# Altium schematic sheet Power.SchDoc
size A3; SheetNumber: 2; SheetTotal: 5
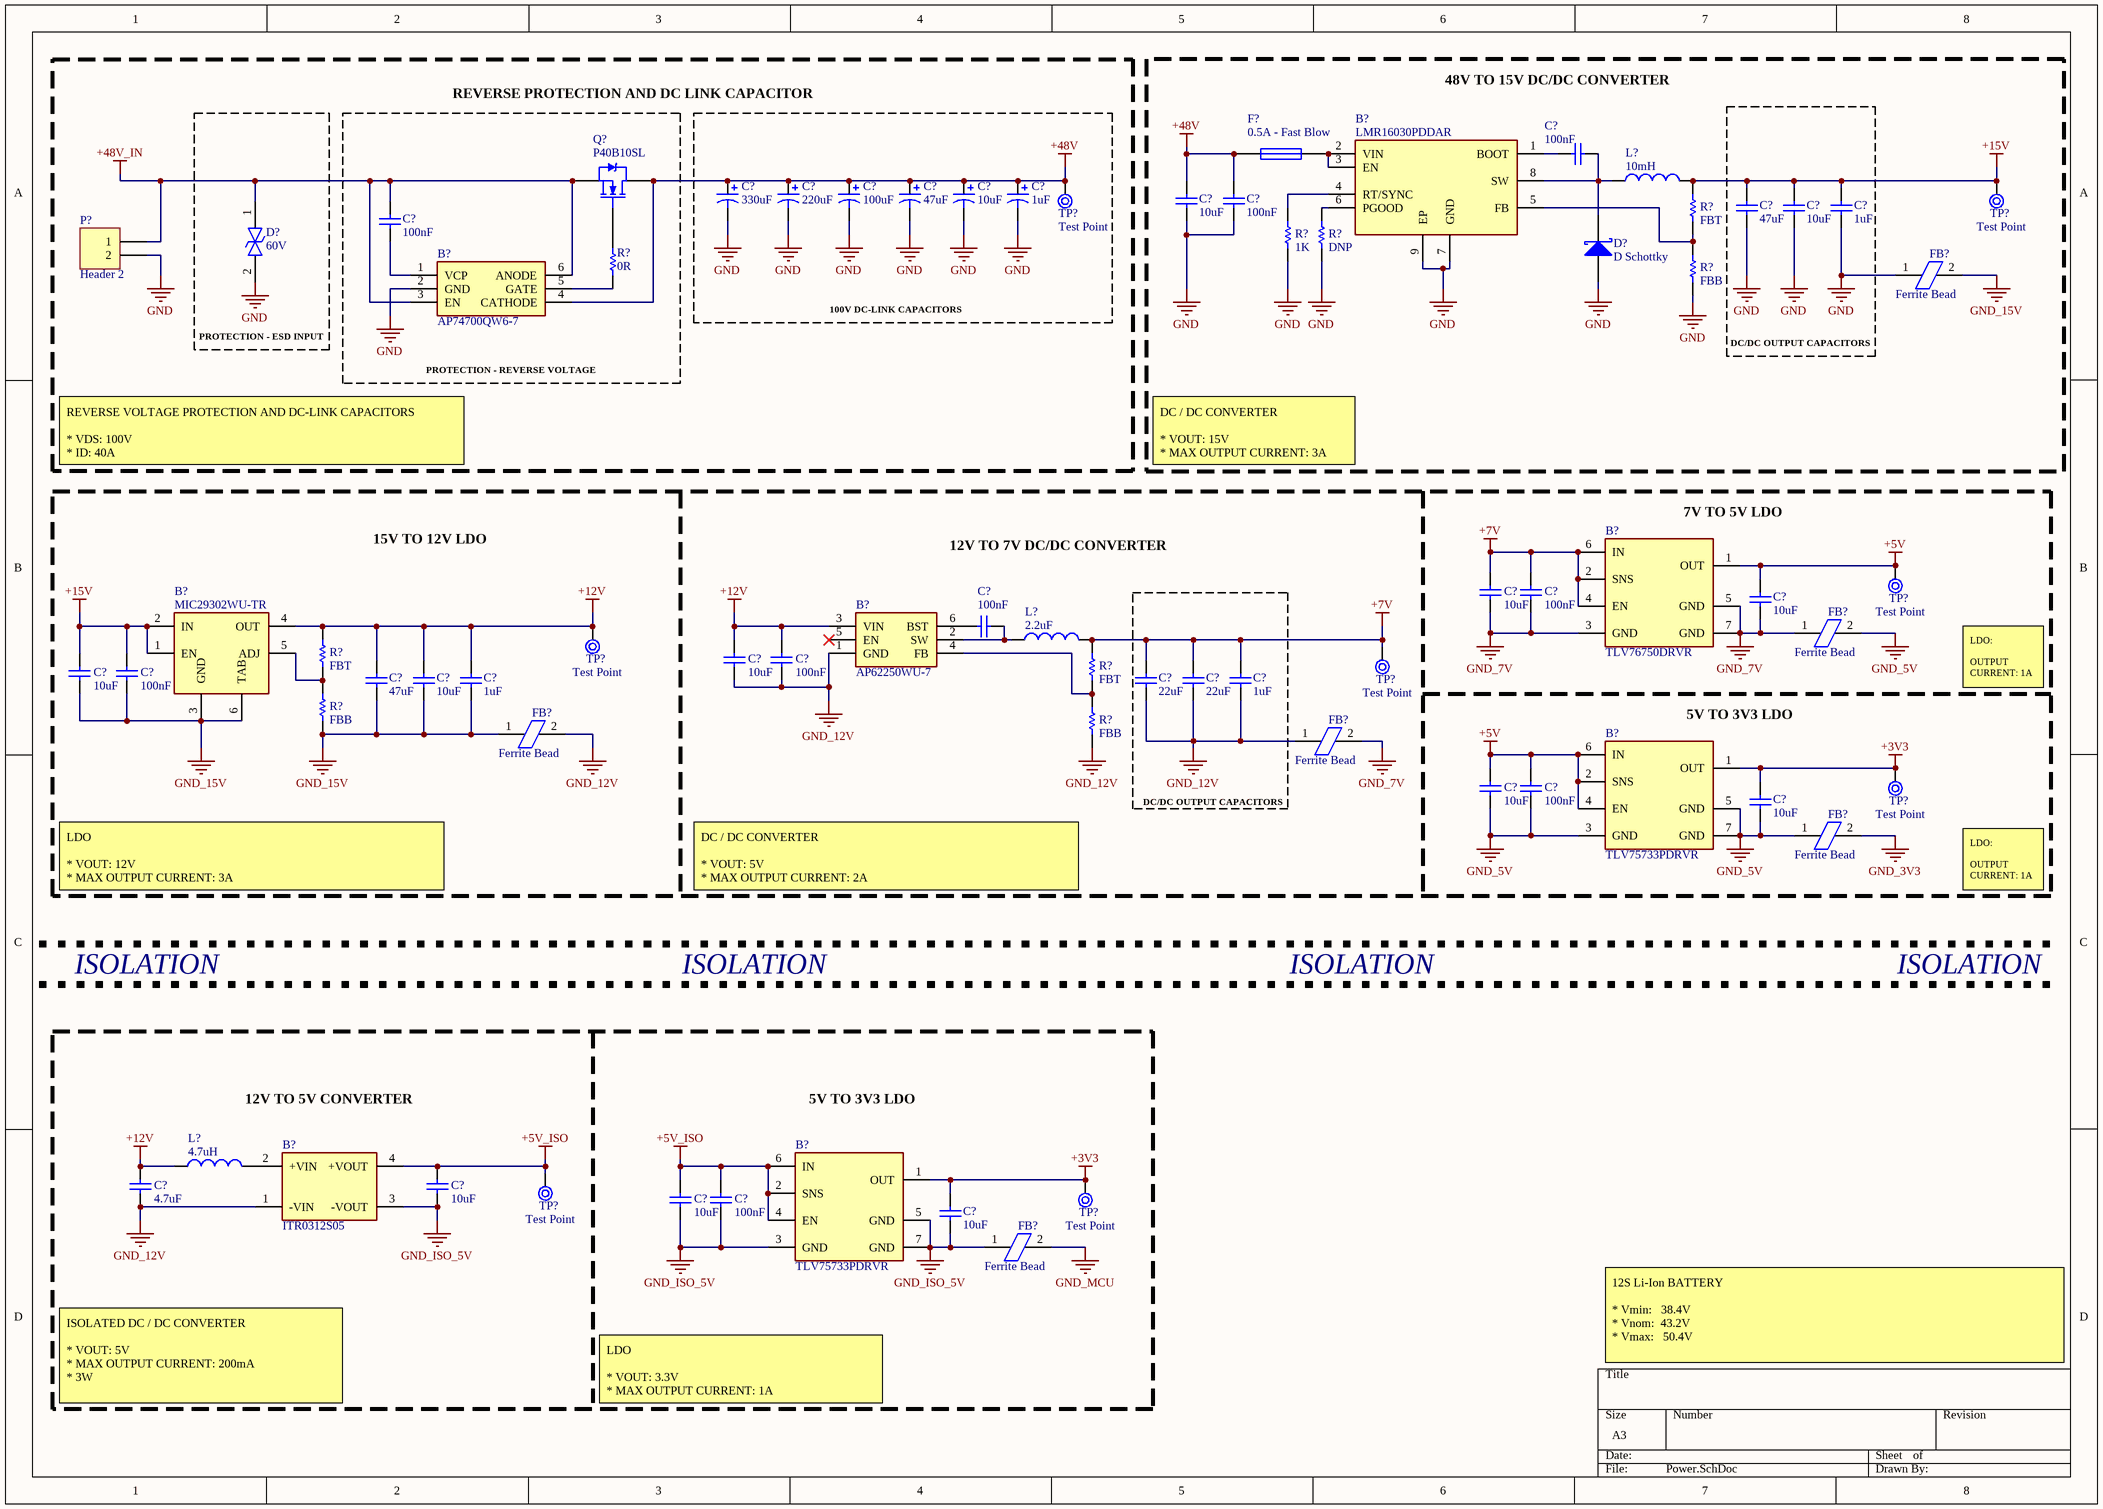
[diagram p0: Power.SchDoc]

## Parts
(Parts that share a designator on the sheet are numbered #1, #2 ... from top to bottom, then left to right.)
B?#1  LMR16030PDDAR
B?#2  AP74700QW6-7
B?#3  TLV76750DRVR  [WSON-6]
B?#4  AP62250WU-7  [TSOT-26-6]
B?#5  MIC29302WU-TR  [TO263-5]
B?#6  TLV75733PDRVR  [WSON-6]
B?#7  TLV75733PDRVR  [WSON-6]
B?#8  ITR0312S05  [SIP-4]
C?#1  value 100nF  (hidden comment: Cap)
C?#2  value 330uF  (hidden comment: Cap Pol2)
C?#3  value 220uF  (hidden comment: Cap Pol2)
C?#4  value 100uF  (hidden comment: Cap Pol2)
C?#5  value 47uF  (hidden comment: Cap Pol2)
C?#6  value 10uF  (hidden comment: Cap Pol2)
C?#7  value 1uF  (hidden comment: Cap Pol2)
C?#8  value 10uF  (hidden comment: Cap)
C?#9  value 100nF  (hidden comment: Cap)
C?#10  value 47uF  (hidden comment: Cap)
C?#11  value 10uF  (hidden comment: Cap)
C?#12  value 1uF  (hidden comment: Cap)
C?#13  value 100nF  (hidden comment: Cap)
C?#14  value 10uF  (hidden comment: Cap)
C?#15  value 100nF  (hidden comment: Cap)
C?#16  value 10uF  (hidden comment: Cap)
C?#17  value 100nF  (hidden comment: Cap)
C?#18  value 10uF  (hidden comment: Cap)
C?#19  value 100nF  (hidden comment: Cap)
C?#20  value 10uF  (hidden comment: Cap)
C?#21  value 100nF  (hidden comment: Cap)
C?#22  value 47uF  (hidden comment: Cap)
C?#23  value 10uF  (hidden comment: Cap)
C?#24  value 1uF  (hidden comment: Cap)
C?#25  value 22uF  (hidden comment: Cap)
C?#26  value 22uF  (hidden comment: Cap)
C?#27  value 1uF  (hidden comment: Cap)
C?#28  value 10uF  (hidden comment: Cap)
C?#29  value 100nF  (hidden comment: Cap)
C?#30  value 10uF  (hidden comment: Cap)
C?#31  value 4.7uF  (hidden comment: Cap)
C?#32  value 10uF  (hidden comment: Cap)
C?#33  value 10uF  (hidden comment: Cap)
C?#34  value 100nF  (hidden comment: Cap)
C?#35  value 10uF  (hidden comment: Cap)
D?#1  60V
D?#2  D Schottky
F?  0.5A - Fast Blow
FB?#1  Ferrite Bead
FB?#2  Ferrite Bead
FB?#3  Ferrite Bead
FB?#4  Ferrite Bead
FB?#5  Ferrite Bead
FB?#6  Ferrite Bead
L?#1  value 10mH  (hidden comment: Inductor)
L?#2  value 2.2uF  (hidden comment: Inductor)
L?#3  value 4.7uH  (hidden comment: Inductor)
P?  Header 2  [HDR1X2]
Q?  P40B10SL
R?#1  value FBT  (hidden comment: Res Small)
R?#2  value 0R  (hidden comment: Res Small)
R?#3  value 1K  (hidden comment: Res Small)
R?#4  value DNP  (hidden comment: Res Small)
R?#5  value FBB  (hidden comment: Res Small)
R?#6  value FBT  (hidden comment: Res Small)
R?#7  value FBT  (hidden comment: Res Small)
R?#8  value FBB  (hidden comment: Res Small)
R?#9  value FBB  (hidden comment: Res Small)
TP?#1  Test Point
TP?#2  Test Point
TP?#3  Test Point
TP?#4  Test Point
TP?#5  Test Point
TP?#6  Test Point
TP?#7  Test Point
TP?#8  Test Point

## Blocks framed on the sheet
REVERSE PROTECTION AND DC LINK CAPACITOR: P?
48V TO 15V DC/DC CONVERTER: B?#1 C?#1 C?#8 C?#9 D?#2 F? FB?#1 L?#1 R?#1 R?#3-R?#5 TP?#2
PROTECTION - ESD INPUT: D?#1
PROTECTION - REVERSE VOLTAGE: B?#2 C?#13 Q? R?#2
100V DC-LINK CAPACITORS: C?#2-C?#7 TP?#1
DC/DC OUTPUT CAPACITORS: C?#10-C?#12
DC/DC OUTPUT CAPACITORS: C?#25-C?#27

## Nets
+3V3: B?#6.1(OUT) B?#7.1(OUT) C?#30.1 C?#35.1 TP?#6.1 TP?#8.1
+5V: B?#3.1(OUT) B?#6.2(SNS) B?#6.4(EN) B?#6.6(IN) C?#16.1 C?#28.1 C?#29.1 TP?#3.1
+5V_ISO: B?#7.2(SNS) B?#7.4(EN) B?#7.6(IN) B?#8.4(+VOUT) C?#32.1 C?#33.1 C?#34.1 TP?#7.1
+7V: B?#3.2(SNS) B?#3.4(EN) B?#3.6(IN) C?#14.1 C?#15.1 C?#25.1 C?#26.1 C?#27.1 L?#2.2 R?#7.2 TP?#5.1
+12V: B?#4.3(VIN) B?#5.4(OUT) C?#18.1 C?#19.1 C?#22.1 C?#23.1 C?#24.1 C?#31.1 L?#3.1 R?#6.2 TP?#4.1
+15V: B?#5.1(EN) B?#5.2(IN) C?#10.1 C?#11.1 C?#12.1 C?#20.1 C?#21.1 L?#1.2 R?#1.2 TP?#2.1
+48V: B?#2.4(CATHODE) C?#2.1 C?#3.1 C?#4.1 C?#5.1 C?#6.1 C?#7.1 C?#8.1 C?#9.1 F?.1 Q?.2(D) TP?#1.1
+48V_IN: B?#2.3(EN) B?#2.6(ANODE) C?#13.1 D?#1.1 P?.1 Q?.3(S)
GND: B?#1.7(GND) B?#1.9(EP) B?#2.2(GND) C?#2.2 C?#3.2 C?#4.2 C?#5.2 C?#6.2 C?#7.2 C?#8.2 C?#9.2 C?#10.2 C?#11.2 C?#12.2 D?#1.2 D?#2.1(A) FB?#1.1 P?.2 R?#3.1 R?#4.1 R?#5.1
GND_3V3: FB?#5.2
GND_5V: B?#6.3(GND) B?#6.5(GND) B?#6.7(GND) C?#28.2 C?#29.2 C?#30.2 FB?#2.2 FB?#5.1
GND_7V: B?#3.3(GND) B?#3.5(GND) B?#3.7(GND) C?#14.2 C?#15.2 C?#16.2 FB?#2.1 FB?#4.2
GND_12V: B?#4.1(GND) B?#8.1(-VIN) C?#18.2 C?#19.2 C?#25.2 C?#26.2 C?#27.2 C?#31.2 FB?#3.2 FB?#4.1 R?#9.1
GND_15V: B?#5.3(GND) B?#5.6(TAB) C?#20.2 C?#21.2 C?#22.2 C?#23.2 C?#24.2 FB?#1.2 FB?#3.1 R?#8.1
GND_ISO_5V: B?#7.3(GND) B?#7.5(GND) B?#7.7(GND) B?#8.3(-VOUT) C?#32.2 C?#33.2 C?#34.2 C?#35.2 FB?#6.1
GND_MCU: FB?#6.2
NetB?#1_1: B?#1.1(BOOT) C?#1.1
NetB?#1_2: B?#1.2(VIN) B?#1.3(EN) F?.2
NetB?#1_4: B?#1.4(RT/SYNC) R?#3.2
NetB?#1_5: B?#1.5(FB) R?#1.1 R?#5.2
NetB?#1_6: B?#1.6(PGOOD) R?#4.2
NetB?#1_8: B?#1.8(SW) C?#1.2 D?#2.2(K) L?#1.1
NetB?#2_1: B?#2.1(VCP) C?#13.2
NetB?#2_5: B?#2.5(GATE) R?#2.2
NetB?#4_2: B?#4.2(SW) C?#17.2 L?#2.1
NetB?#4_4: B?#4.4(FB) R?#7.1 R?#9.2
NetB?#4_6: B?#4.6(BST) C?#17.1
NetB?#5_5: B?#5.5(ADJ) R?#6.1 R?#8.2
NetB?#8_2: B?#8.2(+VIN) L?#3.2
NetQ?_1: Q?.1(G) R?#2.1

Not connected (* = marked no-connect by the designer): B?#4 5(EN)*

## Notes on the sheet
- REVERSE VOLTAGE PROTECTION AND DC-LINK CAPACITORS
  * VDS: 100V
  * ID: 40A
- DC / DC CONVERTER
  * VOUT: 15V
  * MAX OUTPUT CURRENT: 3A
- (near B?#3) 7V TO 5V LDO
- 15V TO 12V LDO
- 12V TO 7V DC/DC CONVERTER
- (near B?#6) 5V TO 3V3 LDO
- LDO:
  OUTPUT CURRENT: 1A
- LDO
  * VOUT: 12V
  * MAX OUTPUT CURRENT: 3A
- DC / DC CONVERTER
  * VOUT: 5V
  * MAX OUTPUT CURRENT: 2A
- ISOLATION
- 12V TO 5V CONVERTER
- 5V TO 3V3 LDO
- ISOLATED DC / DC CONVERTER
  * VOUT: 5V
  * MAX OUTPUT CURRENT: 200mA
  * 3W
- LDO
  * VOUT: 3.3V
  * MAX OUTPUT CURRENT: 1A
- 12S Li-Ion BATTERY
  * Vmin:   38.4V
  * Vnom:  43.2V
  * Vmax:   50.4V

## Library data of the parts
B?#1 = LMR16030PDDAR: Switching Voltage Regulators SIMPLE SWITCHER 60V, 3A Step-Down Converter with 40uA Iq 8-SO PowerPAD -40 to 125
B?#2 = AP74700QW6-7: Power Switch ICs - Power Distribution Load Switch SOT26 T&R 3K; Manufacturer_Name: Diodes Incorporated; Geometry.Height: 1.4mm; Manufacturer_Part_Number: AP74700QW6-7; Mouser Part Number: 621-AP74700QW6-7; Mouser Price/Stock: https://www.mouser.co.uk/ProductDetail/Diodes-Incorporated/AP74700QW6-7?qs=vvQtp7zwQdPsSFAXTBJZqQ%3D%3D; Arrow Part Number: AP74700QW6-7; Arrow Price/Stock: https://www.arrow.com/en/products/ap74700qw6-7/diodes-incorporated?region=nac; Datasheet Link: https://www.diodes.com//assets/Datasheets/AP74700Q.pdf
B?#3 = TLV76750DRVR: LDO Voltage Regulators Adjustable- and fixed-output, 1-A, 16-V, positive-voltage low-dropout (LDO) linear regulator 6-WSON -40 to 125
B?#4 = AP62250WU-7: Buck Switching Regulator IC Positive Adjustable 0.8V 1 Output 2.5A SOT-23-6 Thin, TSOT-23-6
B?#5 = MIC29302WU-TR: Microchip MIC29302WU-TR, LDO Regulator, 3A Adjustable, +/-2%, 2.25  26 Vin 5-Pin D2PAK; Geometry.Height: 4.597mm; Arrow Price/Stock: https://www.arrow.com/en/products/mic29302wu-tr/microchip-technology?region=nac; Datasheet Link: http://ww1.microchip.com/downloads/en/DeviceDoc/20005685A.pdf
B?#6 B?#7 = TLV75733PDRVR: LDO Voltage Regulators 1-A, low-IQ high-accuracy low-dropout (LDO) voltage regulator with enable 6-WSON -40 to 125
B?#8 = ITR0312S05: Isolated DC/DC Converters - Through Hole DC-DC 3W 10% INPUT; Manufacturer_Name: RECOM Power; Manufacturer_Part_Number: RFM-0505S; Geometry.Height: 10.5mm; Mouser Part Number: 919-RFM-0505S; Mouser Price/Stock: https://www.mouser.co.uk/ProductDetail/RECOM-Power/RFM-0505S?qs=lYGu3FyN48dRVYKTH5ipqg%3D%3D; Arrow Part Number: RFM-0505S; Arrow Price/Stock: https://www.arrow.com/en/products/rfm-0505s/recom-power?region=nac; Datasheet Link: https://www.recom-power.com/pdf/Econoline/RFM.pdf
C?#1 C?#8-C?#35 = Cap: Capacitor; Published: 8-Jun-2000; LatestRevisionDate: 17-Jul-2002; LatestRevisionNote: Re-released for DXP Platform.; PackageReference: RAD-0.3; Publisher: Altium Limited; PackageDescription: Radial Cap, Thru-Hole; 2 Leads; 0.3 in Pin Spacing
C?#2-C?#7 = Cap Pol2: Polarized Capacitor (Axial); Published: 8-Jun-2000; LatestRevisionDate: 17-Jul-2002; LatestRevisionNote: Re-released for DXP Platform.; PackageReference: POLAR0.8; Publisher: Altium Limited; PackageDescription: Polarized Capacitor; 2 Leads
D?#1 = TVS: TVS  / ESD Suppressors Diodes Bi-Directional
D?#2 = D Schottky: Schottky Diode; Published: 8-Jun-2000; LatestRevisionDate: 17-Jul-2002; LatestRevisionNote: Re-released for DXP Platform.; PackageReference: SMB; Publisher: Altium Limited; PackageDescription: DO-214-AA/SMB; 2 C-Bend Leads; Body 5.3 x 3.6 mm, inc. leads (LxW); Code_JEDEC: DO-214-AA
F? = Fuse 1: Fuse; Published: 8-Jun-2000; LatestRevisionDate: 17-Jul-2002; LatestRevisionNote: Re-released for DXP Platform.; PackageReference: PIN-W2/E2.8; Publisher: Altium Limited; PackageDescription: Thru-Hole; 2 Leads
L?#1-L?#3 = Inductor: Code_IEC: 1005; Published: 8-Jun-2000; LatestRevisionDate: 29-May-2009; LatestRevisionNote: IPC-7351 Footprint Added.; PackageReference: 0402-A; Publisher: Altium Limited; PackageDescription: Chip Inductor; Code_JEITA: 0402
P? = Header 2: Header, 2-Pin; LatestRevisionDate: 17-Jul-2002; LatestRevisionNote: Re-released for DXP Platform.; Publisher: Altium Limited
Q? = NMOS-2: N-Channel Power MOSFET; Note: Pin 2 is electrically connected to pin 4.; Published: 8-Jun-2000; LatestRevisionDate: 17-Jul-2002; LatestRevisionNote: Re-released for DXP Platform.; DatasheetVersion: PD-9.814; PackageVersion: Feb-1997; PackageReference: TO-220AB; Publisher: Altium Limited; PackageDescription: TO, Thru-Hole, Vertical, Heatsink Mounted; 3 In-Line Leads; Pitch 2.54 mm; ComponentLink1Description: Manufacturer Link; ComponentLink1URL: http://www.irf.com/
R?#1-R?#9 = Res Small: Resistor; Published: 8-Jun-2000; LatestRevisionDate: 17-Jul-2002; LatestRevisionNote: Re-released for DXP Platform.; PackageReference: AXIAL-0.3; Publisher: Altium Limited; PackageDescription: Axial Device, Thru-Hole; 2 Leads; 0.3 in Pin Spacing